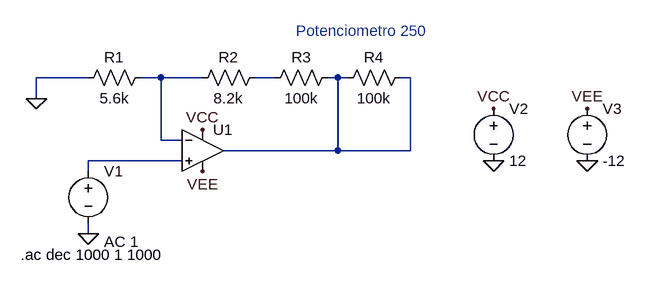
[diagram p0: schematic Amplificador ajustable.asc]
Amplificador ajustable.asc, the LTspice schematic file:
Version 4
SHEET 1 880 680
WIRE -16 64 -96 64
WIRE 96 64 64 64
WIRE 160 64 96 64
WIRE 272 64 240 64
WIRE 368 64 352 64
WIRE 384 64 368 64
WIRE 480 64 464 64
WIRE -96 96 -96 64
WIRE 96 160 96 64
WIRE 128 160 96 160
WIRE 368 176 368 64
WIRE 368 176 192 176
WIRE 480 176 480 64
WIRE 480 176 368 176
WIRE 128 192 -16 192
WIRE -16 208 -16 192
WIRE -16 304 -16 288
FLAG -16 304 0
FLAG -96 96 0
FLAG 608 112 VCC
FLAG 752 112 VEE
FLAG 608 192 0
FLAG 752 192 0
FLAG 160 208 VEE
FLAG 160 144 VCC
SYMBOL OpAmps\\UniversalOpAmp 160 176 R0
SYMATTR InstName U1
SYMBOL voltage -16 192 R0
WINDOW 123 24 124 Left 2
WINDOW 39 0 0 Left 0
SYMATTR Value2 AC 1
SYMATTR InstName V1
SYMATTR Value ""
SYMBOL res 80 48 R90
WINDOW 0 0 56 VBottom 2
WINDOW 3 32 56 VTop 2
SYMATTR InstName R1
SYMATTR Value 5.6k
SYMBOL res 256 48 R90
WINDOW 0 0 56 VBottom 2
WINDOW 3 32 56 VTop 2
SYMATTR InstName R2
SYMATTR Value 8.2k
SYMBOL res 368 48 R90
WINDOW 0 0 56 VBottom 2
WINDOW 3 32 56 VTop 2
SYMATTR InstName R3
SYMATTR Value 100k
SYMBOL res 480 48 R90
WINDOW 0 0 56 VBottom 2
WINDOW 3 32 56 VTop 2
SYMATTR InstName R4
SYMATTR Value 100k
SYMBOL voltage 608 96 R0
WINDOW 123 0 0 Left 0
WINDOW 39 0 0 Left 0
SYMATTR InstName V2
SYMATTR Value 12
SYMBOL voltage 752 96 R0
WINDOW 123 0 0 Left 0
WINDOW 39 0 0 Left 0
SYMATTR InstName V3
SYMATTR Value -12
TEXT 304 -8 Left 2 ;Potenciometro 250
TEXT -120 336 Left 2 !.ac dec 1000 1 1000

The netlist it stands for:
* Amplificador ajustable.asc
XU1 N004 N001 VCC VEE N003 level1 Avol=1Meg GBW=10Meg Vos=0 En=0 Enk=0 In=0 Ink=0 Rin=500Meg  ; pins In+ In- V+ V- OUT
V1 N004 0 AC 1
R1 N001 0 5.6k
R2 N002 N001 8.2k
R3 N003 N002 100k
R4 N003 N003 100k
V2 VCC 0 12
V3 VEE 0 -12
* Potenciometro 250
.ac dec 1000 1 1000
.lib UniversalOpAmp1.lib
.backanno
.end

* Results of the author's LTspice run, read from the files saved beside the schematic
* Operating Point, zero values left out:
*   V(vcc) = 12 V
*   V(vee) = -12 V
*   I(V3) = 24 nA
*   I(V2) = -24 nA
*   Ix(u1:3) = 24 nA
*   Ix(u1:4) = -24 nA